# EAGLE design SynapseWireless-BOB-v13j (EAGLE 5.11)
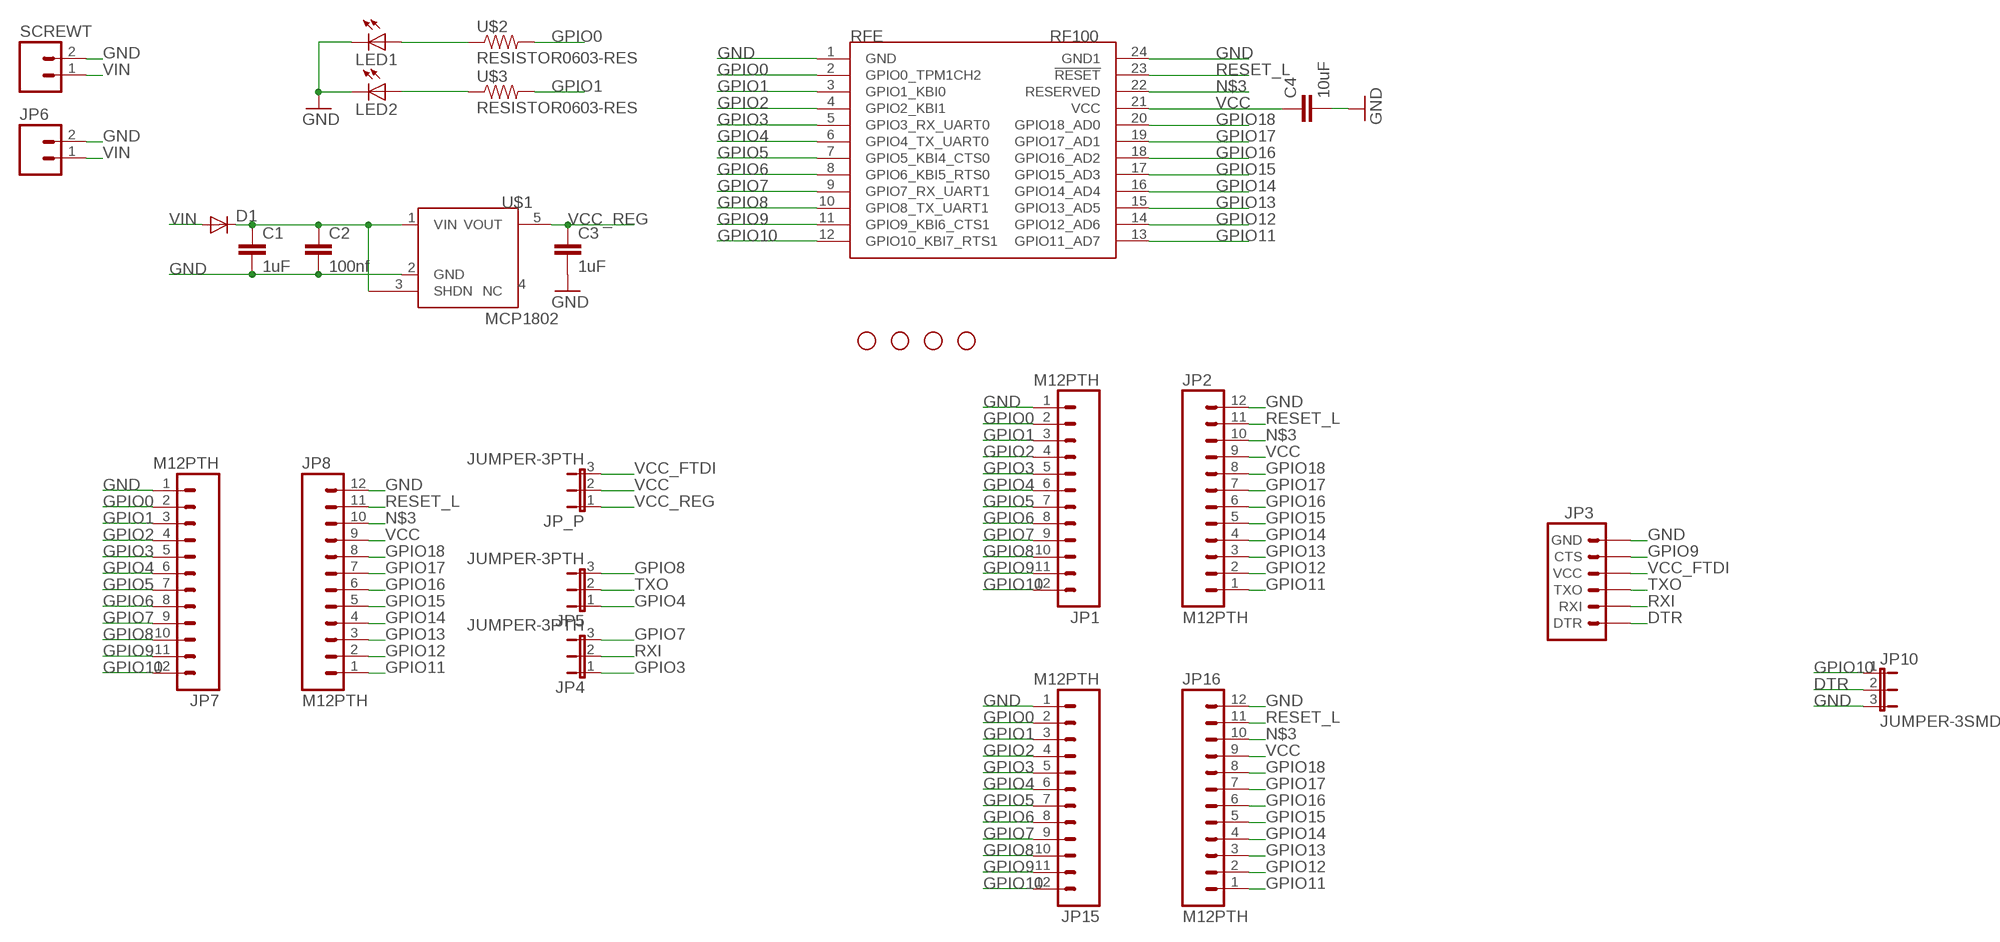
[diagram p0: schematic, sheet 1]

## Parts
C1  1uF  CAP0805  [0805]
C2  100nf  CAP0805  [0805]
C3  1uF  CAP0805  [0805]
C4  10uF  CAP0805  [0805]
D1  DIODESMA  [SMA-DIODE]
JP1  M12PTH  [1X12]
JP2  M12PTH  [1X12]
JP3  ARDUINO_SERIAL_PROGRAMPTH  [1X06]
JP4  JUMPER-3PTH  [1X03]
JP5  JUMPER-3PTH  [1X03]
JP6  M02PTH  [1X02]
JP7  M12PTH  [1X12]
JP8  M12PTH  [1X12]
JP9  STAND-OFF  [STAND-OFF]
JP10  JUMPER-3SMD  [SJ_3]
JP11  STAND-OFF  [STAND-OFF]
JP12  STAND-OFF  [STAND-OFF]
JP13  STAND-OFF  [STAND-OFF]
JP15  M12PTH  [1X12]
JP16  M12PTH  [1X12]
JP_P  JUMPER-3PTH  [1X03]
LED1  LED0603  [LED-0603]
LED2  LED0603  [LED-0603]
RFE  rfe  SYNAPSEWIRELESS-RFENGINE  [SYNAPSERFENGINE-THM-SMT]
SCREWT  M023.5MM  [SCREWTERMINAL-3.5MM-2]
U$1  MCP1802  [SOT23-5]
U$2  RESISTOR0603-RES  [0603-RES]
U$3  RESISTOR0603-RES  [0603-RES]

## Nets
DTR: JP3.1(DTR) JP10.2
GND: C1.2 C2.2 C3.2 C4.2 JP1.1 JP2.12 JP3.6(GND) JP6.2 JP7.1 JP8.12 JP10.3 JP15.1 JP16.12 LED1.C LED2.C RFE.1(GND) RFE.24(GND1) SCREWT.2 U$1.2(GND)
GPIO0: JP1.2 JP7.2 JP15.2 RFE.2(GPIO0_TPM1CH2) U$2.2
GPIO1: JP1.3 JP7.3 JP15.3 RFE.3(GPIO1_KBI0) U$3.2
GPIO2: JP1.4 JP7.4 JP15.4 RFE.4(GPIO2_KBI1)
GPIO3: JP1.5 JP4.1 JP7.5 JP15.5 RFE.5(GPIO3_RX_UART0)
GPIO4: JP1.6 JP5.1 JP7.6 JP15.6 RFE.6(GPIO4_TX_UART0)
GPIO5: JP1.7 JP7.7 JP15.7 RFE.7(GPIO5_KBI4_CTS0)
GPIO6: JP1.8 JP7.8 JP15.8 RFE.8(GPIO6_KBI5_RTS0)
GPIO7: JP1.9 JP4.3 JP7.9 JP15.9 RFE.9(GPIO7_RX_UART1)
GPIO8: JP1.10 JP5.3 JP7.10 JP15.10 RFE.10(GPIO8_TX_UART1)
GPIO9: JP1.11 JP3.5(CTS) JP7.11 JP15.11 RFE.11(GPIO9_KBI6_CTS1)
GPIO10: JP1.12 JP7.12 JP10.1 JP15.12 RFE.12(GPIO10_KBI7_RTS1)
GPIO11: JP2.1 JP8.1 JP16.1 RFE.13(GPIO11_AD7)
GPIO12: JP2.2 JP8.2 JP16.2 RFE.14(GPIO12_AD6)
GPIO13: JP2.3 JP8.3 JP16.3 RFE.15(GPIO13_AD5)
GPIO14: JP2.4 JP8.4 JP16.4 RFE.16(GPIO14_AD4)
GPIO15: JP2.5 JP8.5 JP16.5 RFE.17(GPIO15_AD3)
GPIO16: JP2.6 JP8.6 JP16.6 RFE.18(GPIO16_AD2)
GPIO17: JP2.7 JP8.7 JP16.7 RFE.19(GPIO17_AD1)
GPIO18: JP2.8 JP8.8 JP16.8 RFE.20(GPIO18_AD0)
N$1: C1.1 C2.1 D1.C U$1.1(VIN) U$1.3(SHDN)
N$2: LED1.A U$2.1
N$3: JP2.10 JP8.10 JP16.10 RFE.22(RESERVED)
N$4: LED2.A U$3.1
RESET_L: JP2.11 JP8.11 JP16.11 RFE.23(!RESET)
RXI: JP3.2(RXI) JP4.2
TXO: JP3.3(TXO) JP5.2
VCC: C4.1 JP2.9 JP8.9 JP16.9 JP_P.2 RFE.21(VCC)
VCC_FTDI: JP3.4(VCC) JP_P.3
VCC_REG: C3.1 JP_P.1 U$1.5(VOUT)
VIN: D1.A JP6.1 SCREWT.1
Unconnected: U$1.4(NC)

## Library data of the parts
C1-C4 = 0_jc-custom:CAP: Capacitor Standard 0603 ceramic capacitor, and 0.1" leaded capacitor.
D1 = 0_jc-custom:DIODE: Diode These are standard reverse protection diodes and small signal diodes. SMA package can handle up to about 1A. SOD-323 can handle about 200mA. What the SOD-323 package when ordering, there are some mfgs out there that are 5-pin packages.
JP1 JP2 JP7 JP8 JP15 JP16 = SparkFun:M12: Header 12 Standard 12-pin 0.1" header. Use with straight break away headers (SKU : PRT-00116), right angle break away headers (PRT-00553), swiss pins (PRT-00743), machine pins (PRT-00117), and female headers (PRT-00115).
JP3 = SparkFun:ARDUINO_SERIAL_PROGRAM
JP4 JP5 JP10 JP_P = SparkFun:JUMPER-3
JP6 SCREWT = SparkFun:M02: Header 2 Standard 2-pin 0.1" header. Use with straight break away headers (SKU : PRT-00116), right angle break away headers (PRT-00553), swiss pins (PRT-00743), machine pins (PRT-00117), and female headers (PRT-00115). Molex polarized connector foot print use with SKU : PRT-08233 with associated crimp pins and housings.
JP9 JP11-JP13 = SparkFun:STAND-OFF: Stand Off This is the mechanical footprint for a #4 phillips button head screw. Use the keepout ring to avoid running the screw head into surrounding components. SKU : PRT-00447
LED1 LED2 = 0_jc-custom:LED: LEDs Standard schematic elements and footprints for 5mm, 3mm, 1206, and 0603 sized LEDs. 5mm - Spark Fun Electronics SKU : COM-00529 (and others)
RFE = 0_jc-custom:SYNAPSEWIRELESS-RFENGINE
U$1 = 0_jc-custom:MCP1802
U$2 U$3 = 0_jc-custom:RESISTOR

## Net classes
0 default: width 0.254 mm

## Board
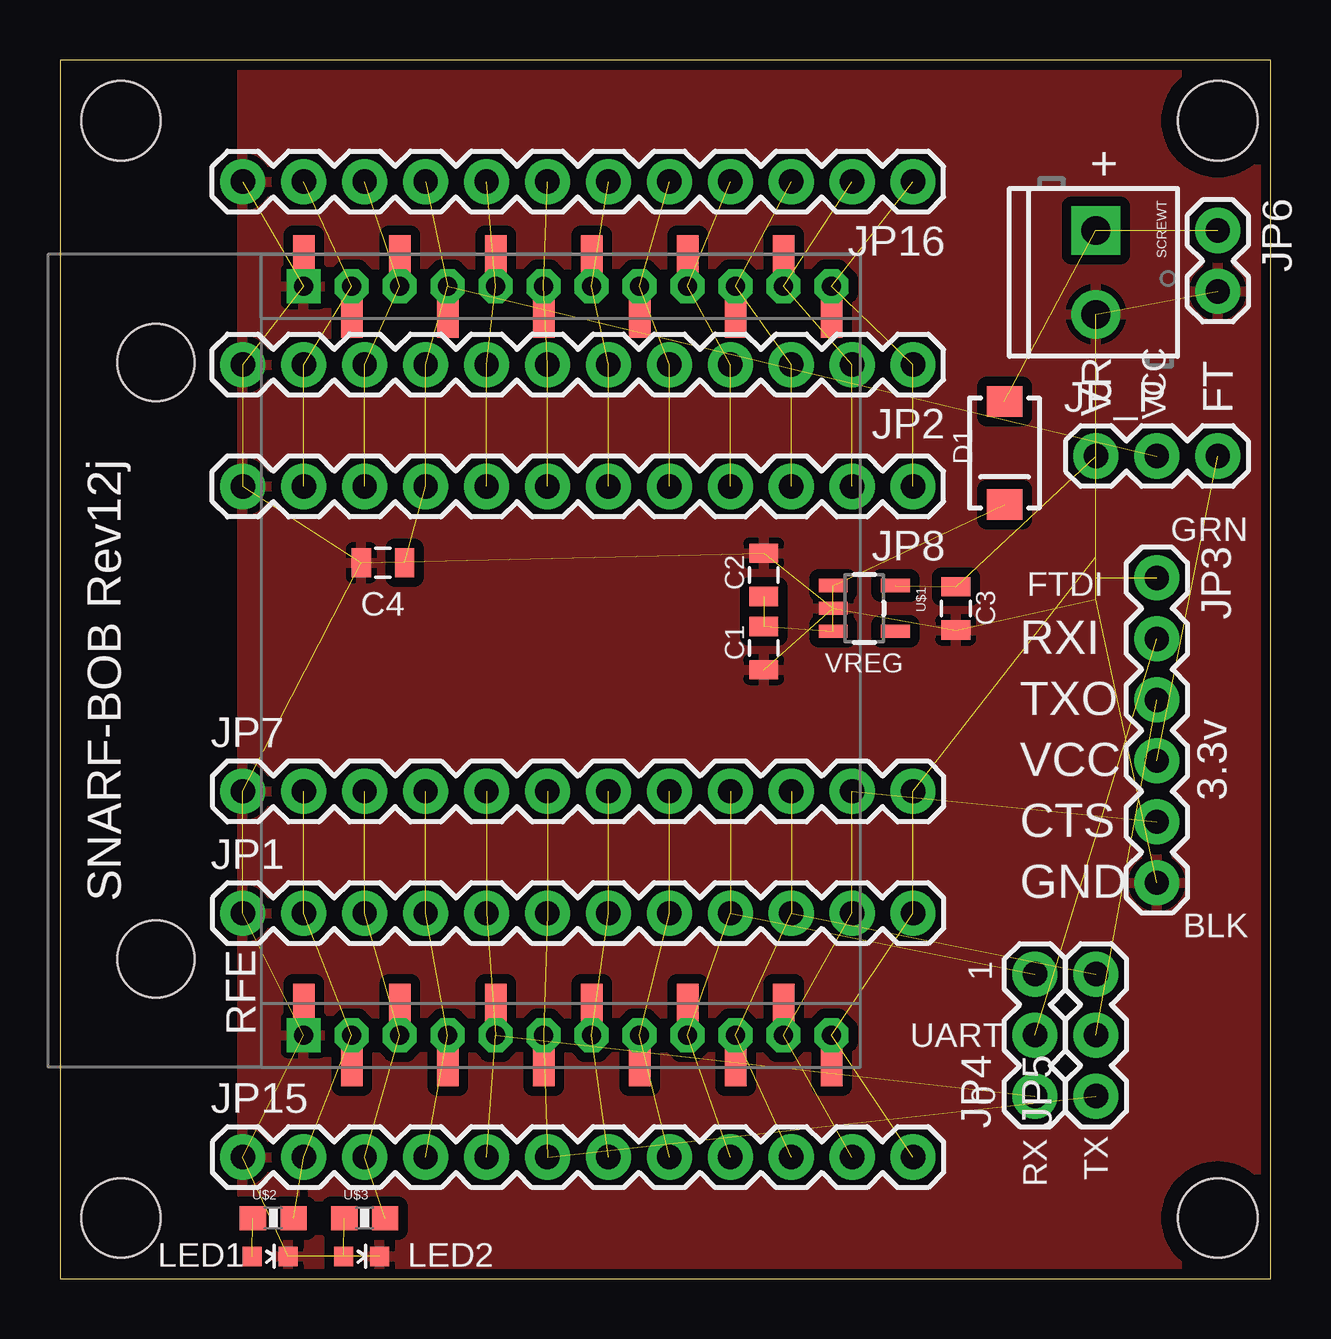
[diagram p1: board, top side]
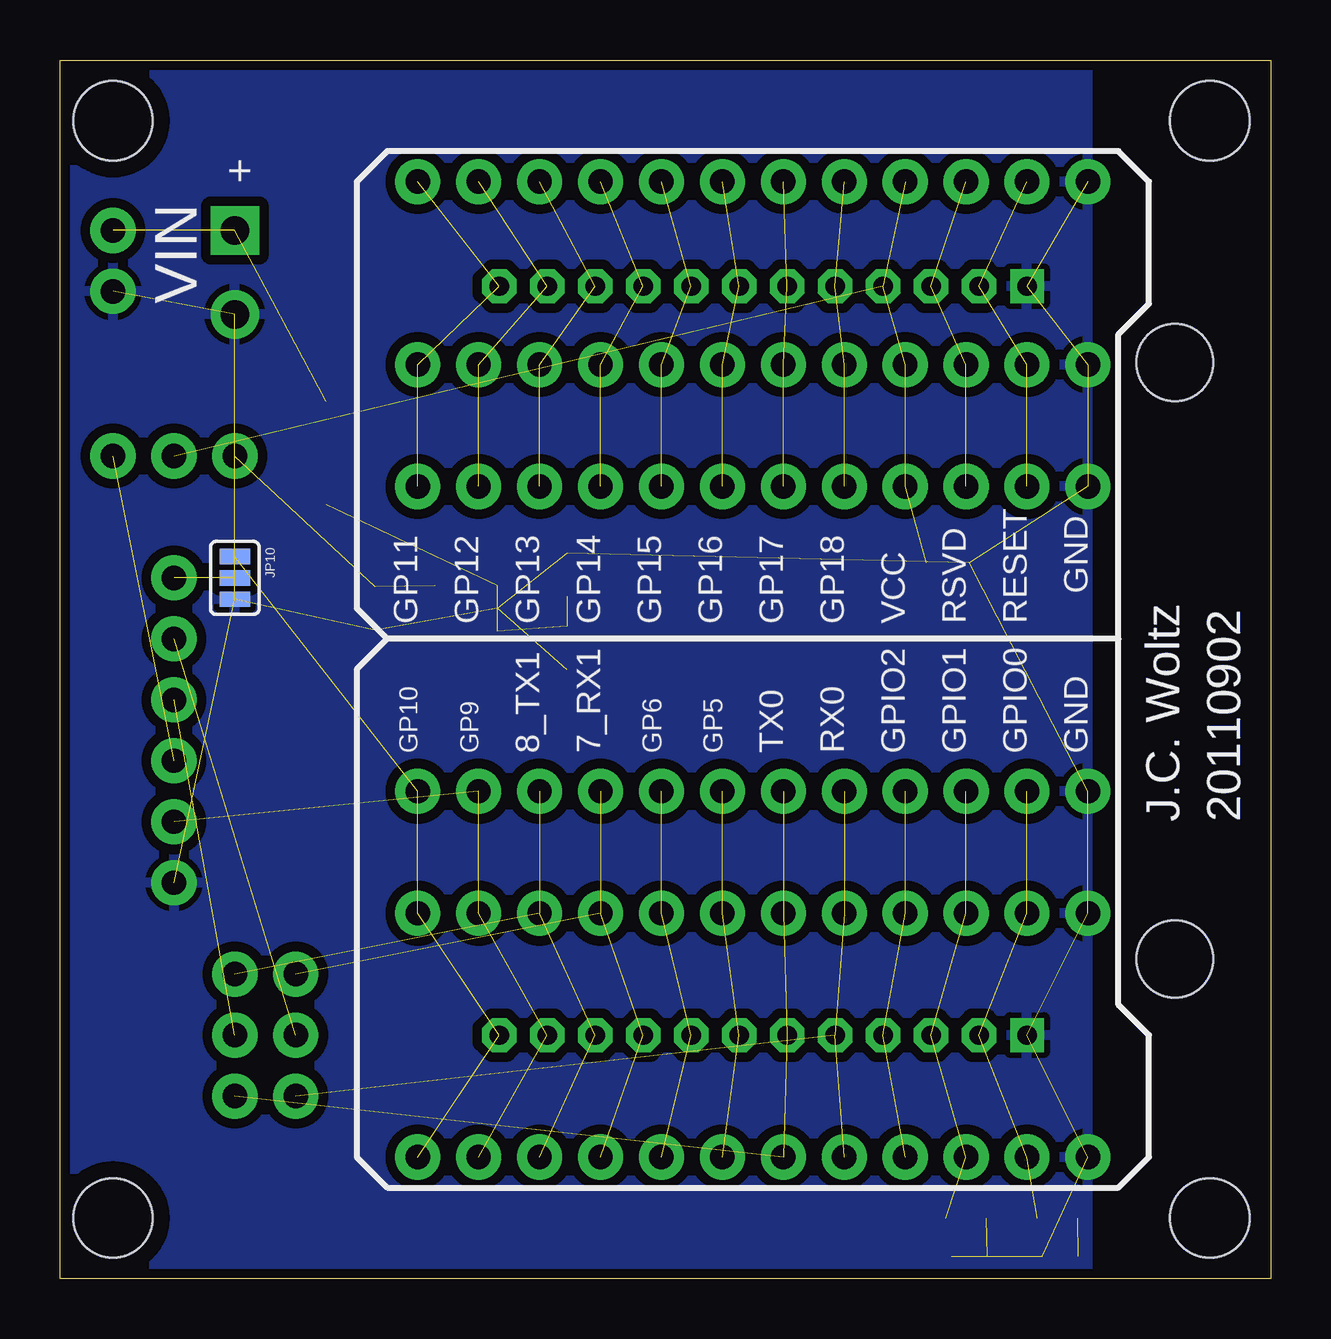
[diagram p2: board, bottom side, seen from below]

Size 50.47 x 50.79 mm. Coordinates in mm from the lower left corner, seen from the top.
Outline: 0,0 50.47,0 50.47,50.79 0,50.79 0,0
Copper layers (1*16): Top 0.0356mm / dielectric 1.5011mm / Bottom 0.0356mm
Design rules "LaenPCBOrder-JCModified": minimum track width 6mil, minimum drill 13mil, track to track 6mil, track to pad 6mil, pad to pad 6mil, via to via 6mil, smd to smd 6mil, copper to edge 15mil, drill to drill 6mil, minimum pad ring 12mil, minimum via ring 7mil, stop-mask expansion 4mil, vias tented up to drill 25mil, thermal gap 10mil

### Footprints (pad centres in the part's own frame; a part is rotated, then mirrored left to right if it is on the bottom)
0805 = smd 0.8 x 1.2: 1 -0.9,0; 2 0.9,0
SMA-DIODE = smd 1.27 x 1.47: A -2.15,0; C 2.15,0
1X12 = drill 1.016 pad 1.88 round: 1 0,0; 2 2.54,0; 3 5.08,0; 4 7.62,0; 5 10.16,0; 6 12.7,0; 7 15.24,0; 8 17.78,0; 9 20.32,0; 10 22.86,0; 11 25.4,0; 12 27.94,0
1X06 = drill 1.016 pad 1.88 round: 1 0,0; 2 2.54,0; 3 5.08,0; 4 7.62,0; 5 10.16,0; 6 12.7,0
1X03 = drill 1.016 pad 1.88 round: 1 0,0; 2 2.54,0; 3 5.08,0
1X02 = drill 1.016 pad 1.88 round: 1 0,0; 2 2.54,0
STAND-OFF = hole 3.302: 0,0
SJ_3 = smd 0.635 x 1.27: 1 -0.889,0; 2 0,0; 3 0.889,0
LED-0603 = smd 0.8 x 0.8: A 0,-0.75; C 0,0.75
SYNAPSERFENGINE-THM-SMT = drill 0.8 square: 1 0,0; 24 31.2,0 | drill 0.8 pad 1.422 octagon: 2 0,-2; 3 0,-4; 4 0,-6; 5 0,-8; 6 0,-10; 7 0,-12; 8 0,-14; 9 0,-16; 10 0,-18; 11 0,-20; 12 0,-22; 13 31.2,-22; 14 31.2,-20; 15 31.2,-18; 16 31.2,-16; 17 31.2,-14; 18 31.2,-12; 19 31.2,-10; 20 31.2,-8; 21 31.2,-6; 22 31.2,-4; 23 31.2,-2 | smd 1.67 x 0.89: P1 1.3,0; P2 -1.3,-2; P3 1.3,-4; P4 -1.3,-6; P5 1.3,-8; P6 -1.3,-10; P7 1.3,-12; P8 -1.3,-14; P9 1.3,-16; P10 -1.3,-18; P11 1.3,-20; P12 -1.3,-22; P13 29.9,-22; P14 32.5,-20; P15 29.9,-18; P16 32.5,-16; P17 29.9,-14; P18 32.5,-12; P19 29.9,-10; P20 32.5,-8; P21 29.9,-6; P22 32.5,-4; P23 29.9,-2; P24 32.5,0 | hole 3.2: 3.17,6.16; 28.03,6.16
SCREWTERMINAL-3.5MM-2 = drill 1.2 pad 2.032 square: 1 0,0 | drill 1.2 pad 2.032 round: 2 3.5,0
SOT23-5 = smd 0.55 x 1.2: 1 -0.95,-1.3; 2 0,-1.3; 3 0.95,-1.3; 4 0.95,1.3; 5 -0.95,1.3
0603-RES = smd 1.1 x 1: 1 -0.85,0; 2 0.85,0

### Placement (x,y rotation side)
C1  29.34,26.29 270 top
C2  29.34,29.34 90 top
C3  37.34,27.94 270 top
C4  13.46,29.84 180 top
D1  39.37,34.42 270 top
JP1  7.62,15.24 0 top
JP2  35.56,38.1 180 top
JP3  45.72,29.21 270 top
JP4  40.64,7.62 90 top
JP5  43.18,7.62 90 top
JP6  48.26,43.69 270 top
JP7  7.62,20.32 0 top
JP8  35.56,33.02 180 top
JP9  2.54,2.54 0 top
JP10  43.18,29.21 270 bottom
JP11  2.54,48.26 0 top
JP12  48.26,48.26 0 top
JP13  48.26,2.54 0 top
JP15  7.62,5.08 0 top
JP16  35.56,45.72 180 top
JP_P  43.18,34.29 0 top
LED1  8.76,0.94 270 top
LED2  12.57,0.94 270 top
RFE  10.16,10.16 90 top
SCREWT  43.18,43.69 270 top
U$1  33.53,27.94 270 top
U$2  8.89,2.54 0 top
U$3  12.7,2.54 0 top

### Tracks (layer width: path | path; a pad name or v marks a point on that pad's centre or on a via)
DTR  (1 unrouted)
GND  (18 unrouted)
  pour Bottom (isolate 0.406): 7.62,50.8 50.8,50.8 50.8,0 7.62,0
  pour Top (isolate 0.406): 7.62,50.8 50.8,50.8 50.8,0 7.62,0
GPIO0  (4 unrouted)
GPIO1  (4 unrouted)
GPIO2  (3 unrouted)
GPIO3  (4 unrouted)
GPIO4  (4 unrouted)
GPIO5  (3 unrouted)
GPIO6  (3 unrouted)
GPIO7  (4 unrouted)
GPIO8  (4 unrouted)
GPIO9  (4 unrouted)
GPIO10  (4 unrouted)
GPIO11  (3 unrouted)
GPIO12  (3 unrouted)
GPIO13  (3 unrouted)
GPIO14  (3 unrouted)
GPIO15  (3 unrouted)
GPIO16  (3 unrouted)
GPIO17  (3 unrouted)
GPIO18  (3 unrouted)
N$1  (4 unrouted)
N$2  (1 unrouted)
N$3  (3 unrouted)
N$4  (1 unrouted)
RESET_L  (3 unrouted)
RXI  (1 unrouted)
TXO  (1 unrouted)
VCC  (5 unrouted)
VCC_FTDI  (1 unrouted)
VCC_REG  (2 unrouted)
VIN  (2 unrouted)

### Text on the board
tPlace: + | VR | VCC | FT | GRN | FTDI | RXI | VREG | TXO | VCC | 3.3v | CTS | SNARF-BOB Rev12j | GND | BLK | 1 | UART | 0 | RX | TX
bPlace: + | VIN | GND | RESET | RSVD | VCC | GP18 | GP17 | GP16 | GP15 | GP14 | GP13 | GP12 | GP11 | GND | GPIO0 | GPIO1 | GPIO2 | RX0 | TX0 | GP5 | GP6 | 7_RX1 | 8_TX1 | GP9 | GP10 | 20110902 | J.C. Woltz